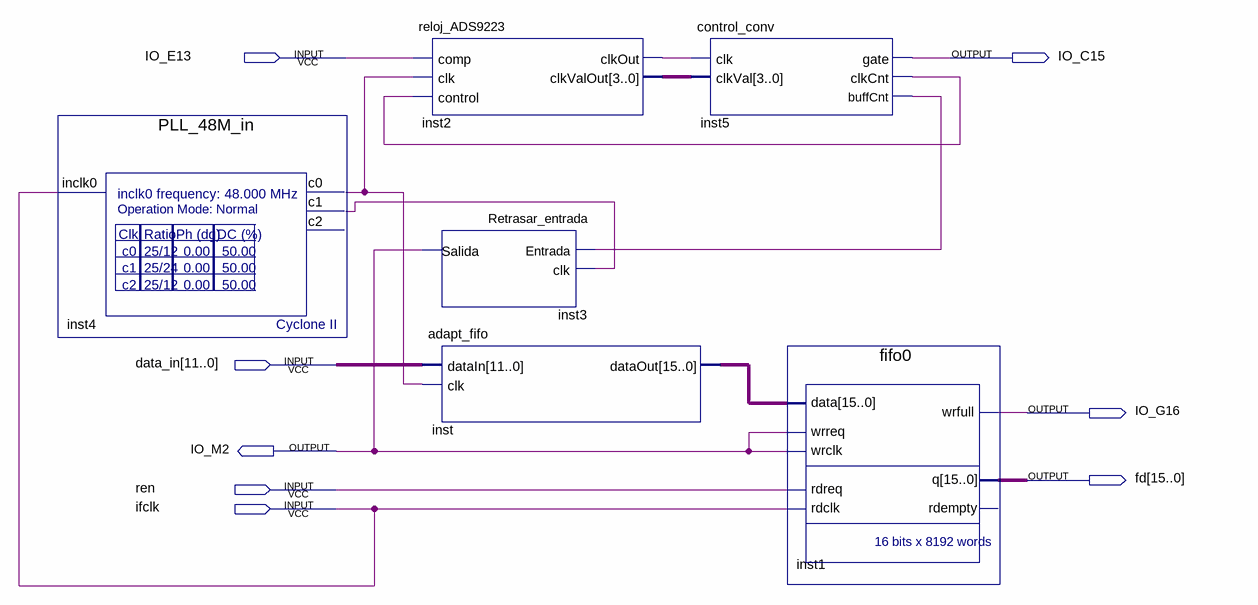
[diagram p0: schematic sheet]
// Quartus schematic Template.bdf as structural Verilog: 6 symbols, 8 pins
module Template (
  input  IO_E13,
  input  [11:0] data_in,
  input  ren,
  input  ifclk,
  output IO_C15,
  output IO_G16,
  output IO_M2,
  output [15:0] fd
);

  wire inst2_clkout, inst4_c0, inst4_c1, inst5_buffcnt, inst5_clkcnt;
  wire [3:0] inst2_clkvalout;
  wire [15:0] inst_dataout;

  PLL_48M_in inst4 (.inclk0(ifclk), .c0(inst4_c0), .c1(inst4_c1));  // open: c2
  reloj_ADS9223 inst2 (
    .comp(IO_E13), .clk(inst4_c0), .control(inst5_clkcnt), .clkOut(inst2_clkout), .clkValOut(inst2_clkvalout));
  Retrasar_entrada inst3 (.Entrada(inst5_buffcnt), .clk(inst4_c1), .Salida(IO_M2));
  adapt_fifo inst (.dataIn(data_in), .clk(inst4_c0), .dataOut(inst_dataout));
  control_conv inst5 (
    .clk(inst2_clkout), .clkVal(inst2_clkvalout), .gate(IO_C15), .clkCnt(inst5_clkcnt),
    .buffCnt(inst5_buffcnt));
  fifo0 inst1 (
    .data(inst_dataout), .wrreq(IO_M2), .wrclk(IO_M2), .rdreq(ren), .rdclk(ifclk), .wrfull(IO_G16), .q(fd));  // open: rdempty
endmodule
